# Altium schematic sheet SOM_IO3.SchDoc
size A4
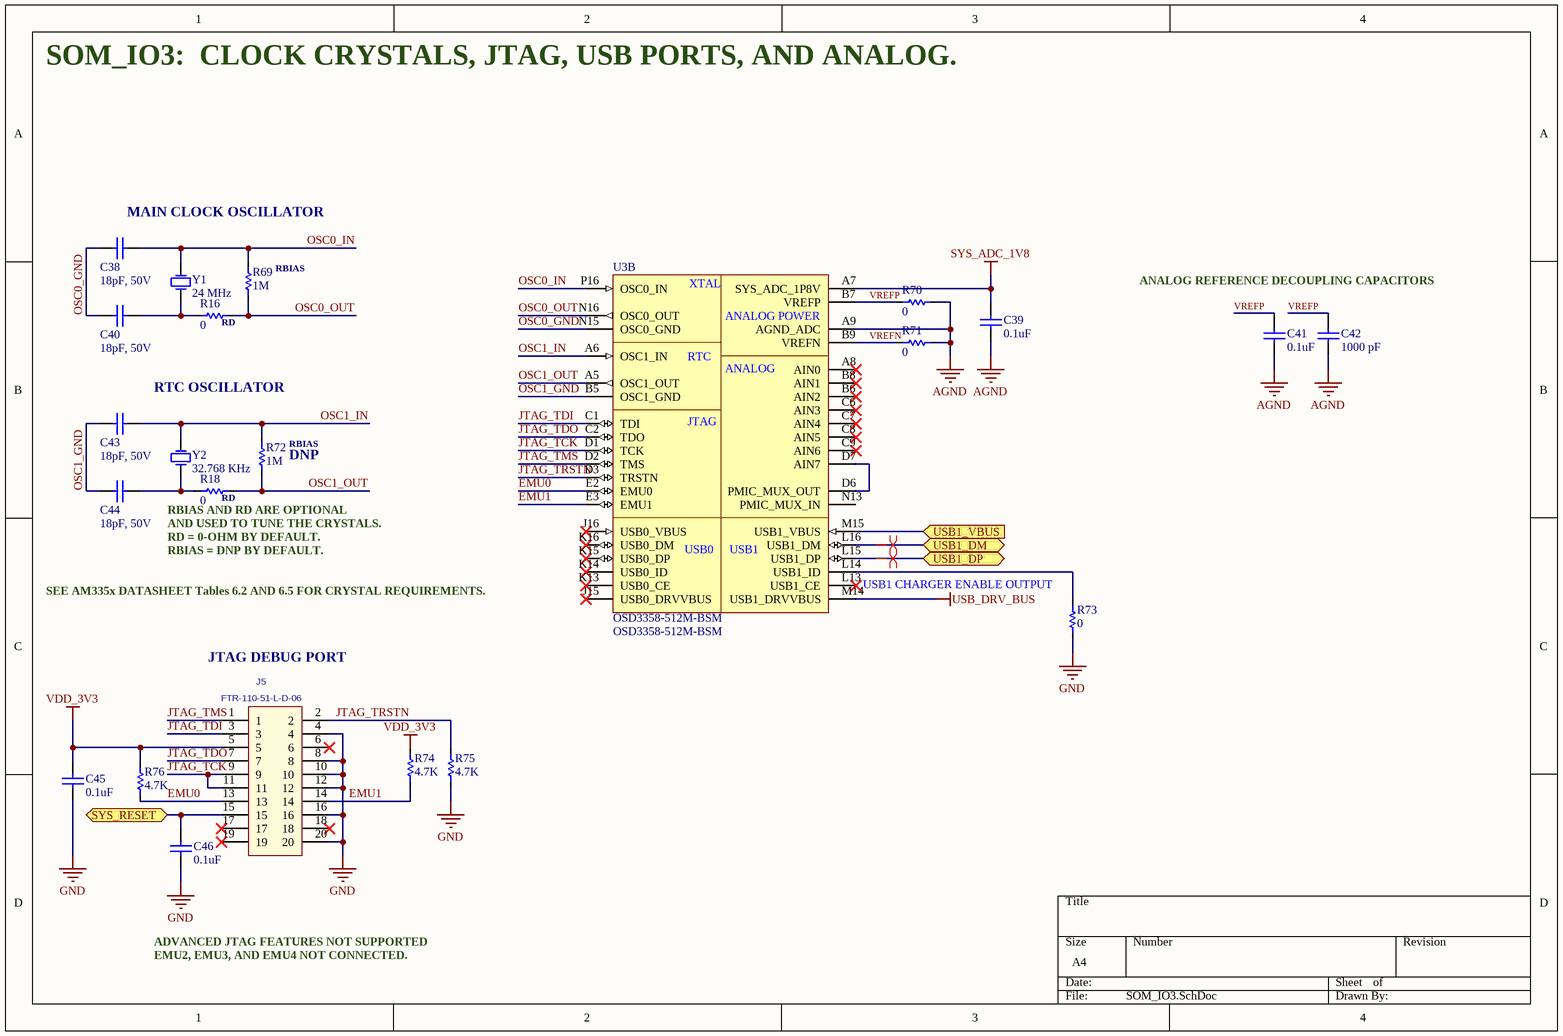
[diagram p0: SOM_IO3.SchDoc]

## Parts
C38  18pF, 50V  [CAP_0603]
C39  0.1uF  [CAP_0603]
C40  18pF, 50V  [CAP_0603]
C41  0.1uF  [CAP_0603]
C42  1000 pF  [CAP_0603]
C43  18pF, 50V  [CAP_0603]
C44  18pF, 50V  [CAP_0603]
C45  0.1uF  [CAP_0603]
C46  0.1uF  [CAP_0603]
J5  FTR-110-51-L-D-06  [HEADER_2X10_1.7MM]
R16  0  [RES_0603]
R18  0  [RES_0603]
R69  1M  [RES_0603]
R70  0  [RES_0603]
R71  0  [RES_0603]
R72  1M  [RES_0603]
R73  0  [RES_0603]
R74  4.7K  [RES_0603]
R75  4.7K  [RES_0603]
R76  4.7K  [RES_0603]
U3  OSD3358-512M-BSM  [BGA256C127P16X16_2100X2100X308]  (part B of 6)
Y1  24 MHz  [7A-24MHz]
Y2  32.768 KHz  [ABS07]

## Ports
SYS_RESET (bidir), USB1_DM (bidir), USB1_DP (bidir), USB1_VBUS (in)

## Nets
AGND: C39.1 C41.1 C42.1 R70.2 R71.2 U3.A9(AGND_ADC)
GND: C45.1 C46.1 J5.4 J5.8 J5.10 J5.12 J5.16 J5.20 R73.2 R75.1
SYS_ADC_1V8: C39.2 U3.A7(SYS_ADC_1P8V)
USB_DRV_BUS: U3.M14(USB1_DRVVBUS)
VDD_3V3: C45.2 J5.5 R74.2 R76.2
EMU0: J5.13 R76.1 U3.E2(EMU0)
EMU1: J5.14 R74.1 U3.E3(EMU1)
JTAG_TCK: J5.9 J5.11 U3.D1(TCK)
JTAG_TDI: J5.3 U3.C1(TDI)
JTAG_TDO: J5.7 U3.C2(TDO)
JTAG_TMS: J5.1 U3.D2(TMS)
JTAG_TRSTN: J5.2 R75.2 U3.D3(TRSTN)
OSC0_GND: C38.2(P) C40.2(P) U3.N15(OSC0_GND)
OSC0_IN: C38.1(N) R69.2 U3.P16(OSC0_IN) Y1.2(OSC2)
OSC0_OUT: R16.2 R69.1 U3.N16(OSC0_OUT)
OSC1_GND: C43.2(P) C44.2(P) U3.B5(OSC1_GND)
OSC1_IN: C43.1(N) R72.2 U3.A6(OSC1_IN) Y2.2(OSC2)
OSC1_OUT: R18.2 R72.1 U3.A5(OSC1_OUT)
SYS_RESET: C46.2 J5.15 ; port SYS_RESET
USB1_DM: U3.L16(USB1_DM) ; port USB1_DM
USB1_DP: U3.L15(USB1_DP) ; port USB1_DP
USB1_VBUS: U3.M15(USB1_VBUS) ; port USB1_VBUS
VREFN: R71.1 U3.B9(VREFN)
VREFP: C41.2 C42.2 R70.1 U3.B7(VREFP)
NetC40_1: C40.1(N) R16.1 Y1.1(OSC1)
NetC44_1: C44.1(N) R18.1 Y2.1(OSC1)
NetR73_1: R73.1 U3.L14(USB1_ID)
NetU3_D6: U3.D6(PMIC_MUX_OUT) U3.D7(AIN7)

Not connected (* = marked no-connect by the designer): J5 6* 17* 18* 19*; U3 A8(AIN0)* B6(AIN2)* B8(AIN1)* C6(AIN3)* C7(AIN4)* C8(AIN5)* C9(AIN6)* J15(USB0_DRVVBUS)* J16(USB0_VBUS)* K13(USB0_CE)* K14(USB0_ID)* K15(USB0_DP)* K16(USB0_DM)* L13(USB1_CE)* N13(PMIC_MUX_IN)

## Layout directives
differential pair; net class Z90_DIFF; differential pair class USB: USB1_DM, USB1_DP

## Notes on the sheet
- SOM_IO3:  CLOCK CRYSTALS, JTAG, USB PORTS, AND ANALOG.
- (near C38) MAIN CLOCK OSCILLATOR
- (near R69) RBIAS
- ANALOG REFERENCE DECOUPLING CAPACITORS
- (near R16) RD
- RTC OSCILLATOR
- (near R72) RBIAS
- (near R18) RBIAS AND RD ARE OPTIONAL
- (near R18) RD
- (near R72) DNP
- (near R18) AND USED TO TUNE THE CRYSTALS.
- RD = 0-OHM BY DEFAULT.
- RBIAS = DNP BY DEFAULT.
- SEE AM335x DATASHEET Tables 6.2 AND 6.5 FOR CRYSTAL REQUIREMENTS.
- USB1 CHARGER ENABLE OUTPUT
- JTAG DEBUG PORT
- ADVANCED JTAG FEATURES NOT SUPPORTED
- EMU2, EMU3, AND EMU4 NOT CONNECTED.
- (in symbol SOM-OSD3358-512M-BSM, part B) XTAL; ANALOG POWER; RTC /; ANALOG; JTAG; USB0; USB1

## Library data of the parts
C38 C40 C43 C44 = C0603C180D5GACTU: CAP CER 18PF 50V C0G/NP0 0603 +/- 0.5 PF; Manufacturer: KEMET; Tolerance: 0.5 pF; Rated Voltage: 50 VDC; ComponentLink1Description: Manufacturer; ComponentLink1URL: http://www.we-online.de; ComponentLink2Description: Datasheet; ComponentLink2URL: https://katalog.we-online.com/pbs/datasheet/865080345012.pdf; Mounting Technology: SMD; Value: 18 pF; Manufacturer Part No.: C0603C180D5GACTU; Datasheet: *; Supplier: Digi-Key; Package Reference: CAP_0603; Supplier Part No.: 399-9018-1-ND; Package Description: 0603
C39 C41 C45 C46 = C0603C104M4RACTU: CAP CER 0.1UF 16V X7R 0603; Manufacturer: KEMET; Tolerance: 20%; ComponentLink1Description: Manufacturer; ComponentLink1URL: http://www.we-online.de; Value: 0.1uF; Rated Voltage: 16V; Ceramic Type: X7R; Supplier Part No.: 399-1099-1-ND; Package Reference: CAP_0603; Package Description: 0603; Mounting Technology: SMD; Manufacturer Part No.: C0603C104M4RACTU; Datasheet: https://content.kemet.com/datasheets/KEM_C1002_X7R_SMD.pdf; Supplier: Digi-Key; ComponentLink2Description: Datasheet; ComponentLink2URL: https://content.kemet.com/datasheets/KEM_C1002_X7R_SMD.pdf
C42 = C0603X102J4RECAUTO: CAP CER 0603 1NF 16V X7R 5%; Manufacturer: KEMET; ComponentLink1Description: Manufacturer; ComponentLink1URL: http://www.we-online.de; Value: 1000 pF; Rated Voltage: 16V; Ceramic Type: X7R; Supplier Part No.: 399-17840-1-ND; Package Reference: CAP_0603; Package Description: 0603; Mounting Technology: SMD; Manufacturer Part No.: C0603X102J4RECAUTO; Datasheet: https://content.kemet.com/datasheets/KEM_C1002_X7R_SMD.pdf; Tolerance: 5%; Supplier: Digi-Key; ComponentLink2Description: Datasheet; ComponentLink2URL: https://content.kemet.com/datasheets/KEM_C1002_X7R_SMD.pdf
J5 = FTR-110-51-L-D-06: CONN HEADER SMD 20POS 1.27MM; Manufacturer: SAMTEC; Manufacturer Part No.: FTR-110-51-L-D-06; Supplier: Digi-Key; Mounting Technology: SMD; Supplier Part No.: SAM11229-ND; Package Description: Header 2x10 1.7MM; Datasheet: *; Package Reference: HEADER_2X10_1.7MM
R16 R18 R70 R71 R73 = RC0603JR-070RL: RES SMD 0 OHM JUMPER 1/10W 0603; Manufacturer: Yageo; Manufacturer Part No.: RC0603JR-070RL; Date: 2020; ComponentLink1Description: Manufacturer Link; ComponentLink1URL: http://www.vishay.com/company/brands/dale/; ComponentLink2Description: Datasheet; ComponentLink2URL: http://www.vishay.com/docs/20035/dcrcwe3.pdf; Supplier: Digikey; Supplier Part No.: 311-0.0GRCT-ND; Datasheet: https://www.yageo.com/upload/media/product/productsearch/datasheet/rchip/PYu-RC_Group_51_RoHS_L_10.pdf; Package Reference: RES_0603; Package Description: 0603; Mounting Technology: SMD; Value: 0; Power Rating: 1/10W
R69 R72 = RC0603JR-071ML: RES SMD 1M OHM 5% 1/10W 0603; Manufacturer: Yageo; Tolerance: 5%; Manufacturer Part No.: RC0603JR-071ML; Date: 2020; ComponentLink1Description: Manufacturer Link; ComponentLink1URL: http://www.vishay.com/company/brands/dale/; ComponentLink2Description: Datasheet; ComponentLink2URL: http://www.vishay.com/docs/20035/dcrcwe3.pdf; Supplier: Digikey; Supplier Part No.: 311-1.0MGRCT-ND; Datasheet: https://www.yageo.com/upload/media/product/productsearch/datasheet/rchip/PYu-RC_Group_51_RoHS_L_10.pdf; Package Reference: RES_0603; Package Description: 0603; Mounting Technology: SMD; Value: 1M; Power Rating: 1/10W
R74-R76 = RC0603JR-074K7L: RES SMD 4.7K OHM 5% 1/10W 0603; Manufacturer: Yageo; Value: 4.7K; Tolerance: 5%; Manufacturer Part No.: RC0603JR-074K7L; Date: 2020; ComponentLink1Description: Manufacturer Link; ComponentLink1URL: http://www.vishay.com/company/brands/dale/; ComponentLink2Description: Datasheet; ComponentLink2URL: http://www.vishay.com/docs/20035/dcrcwe3.pdf; Supplier: Digikey; Supplier Part No.: 311-4.7KGRCT-ND; Datasheet: https://www.yageo.com/upload/media/product/productsearch/datasheet/rchip/PYu-RC_Group_51_RoHS_L_10.pdf; Package Reference: RES_0603; Package Description: 0603; Mounting Technology: SMD; Power Rating: 1/10W
U3 = SOM-OSD3358-512M-BSM: OSD3358-512M-BSM , 256-FBGA, 21mmx21mmx3mm; Manufacturer: Octavo Systems; Package: FBGA; Pin Count: 256-ball; Mounting Technology: SMD; ComponentLink1Description: Manufacturer URL; ComponentLink1URL: http://www.octavosystems.com/; PartNumber: OSD3358-512M-BSM; Package Description: 256-Ball Grid Array, 21x21x3 mm, Pitch 1.27 mm; Package Reference: FBGA-256; Supplier: Digi-Key; Supplier Part No.: 1676-1002-ND
Y1 = 7A-24.000MAAJ-T: CRYSTAL 24.0000MHZ 18PF SMD; Manufacturer: TXC CORPORATION; Date: 2020; ComponentLink1Description: Manufacturer Link; ComponentLink1URL: http://www.ecsxtal.com/; ComponentLink2Description: Data Sheet; Supplier Part No.: 887-1090-1-ND; Supplier: Digikey; Package Reference: 7A-24MHz; Package Description: 7A-24MHz; Mounting Technology: SMD; Manufacturer Part No.: 7A-24.000MAAJ-T; Datasheet: CRYSTAL 24.0000MHZ 18PF SMD; Value: 24 MHz
Y2 = ABS07-32.768KHZ-T: CRYSTAL 32.7680KHZ 12.5PF SMD; Manufacturer: Abracon LLC; Date: 2020; ComponentLink1Description: Manufacturer Link; ComponentLink1URL: http://www.ecsxtal.com/; ComponentLink2Description: Data Sheet; Supplier Part No.: 535-9542-1-ND; Supplier: Digikey; Package Reference: ABS07; Package Description: ABS07; Mounting Technology: SMD; Manufacturer Part No.: ABS07-32.768KHZ-T; Value: 32.768 KHz